# EAGLE design Threeno Tiny Tx Rev1B (EAGLE 9.6.2)
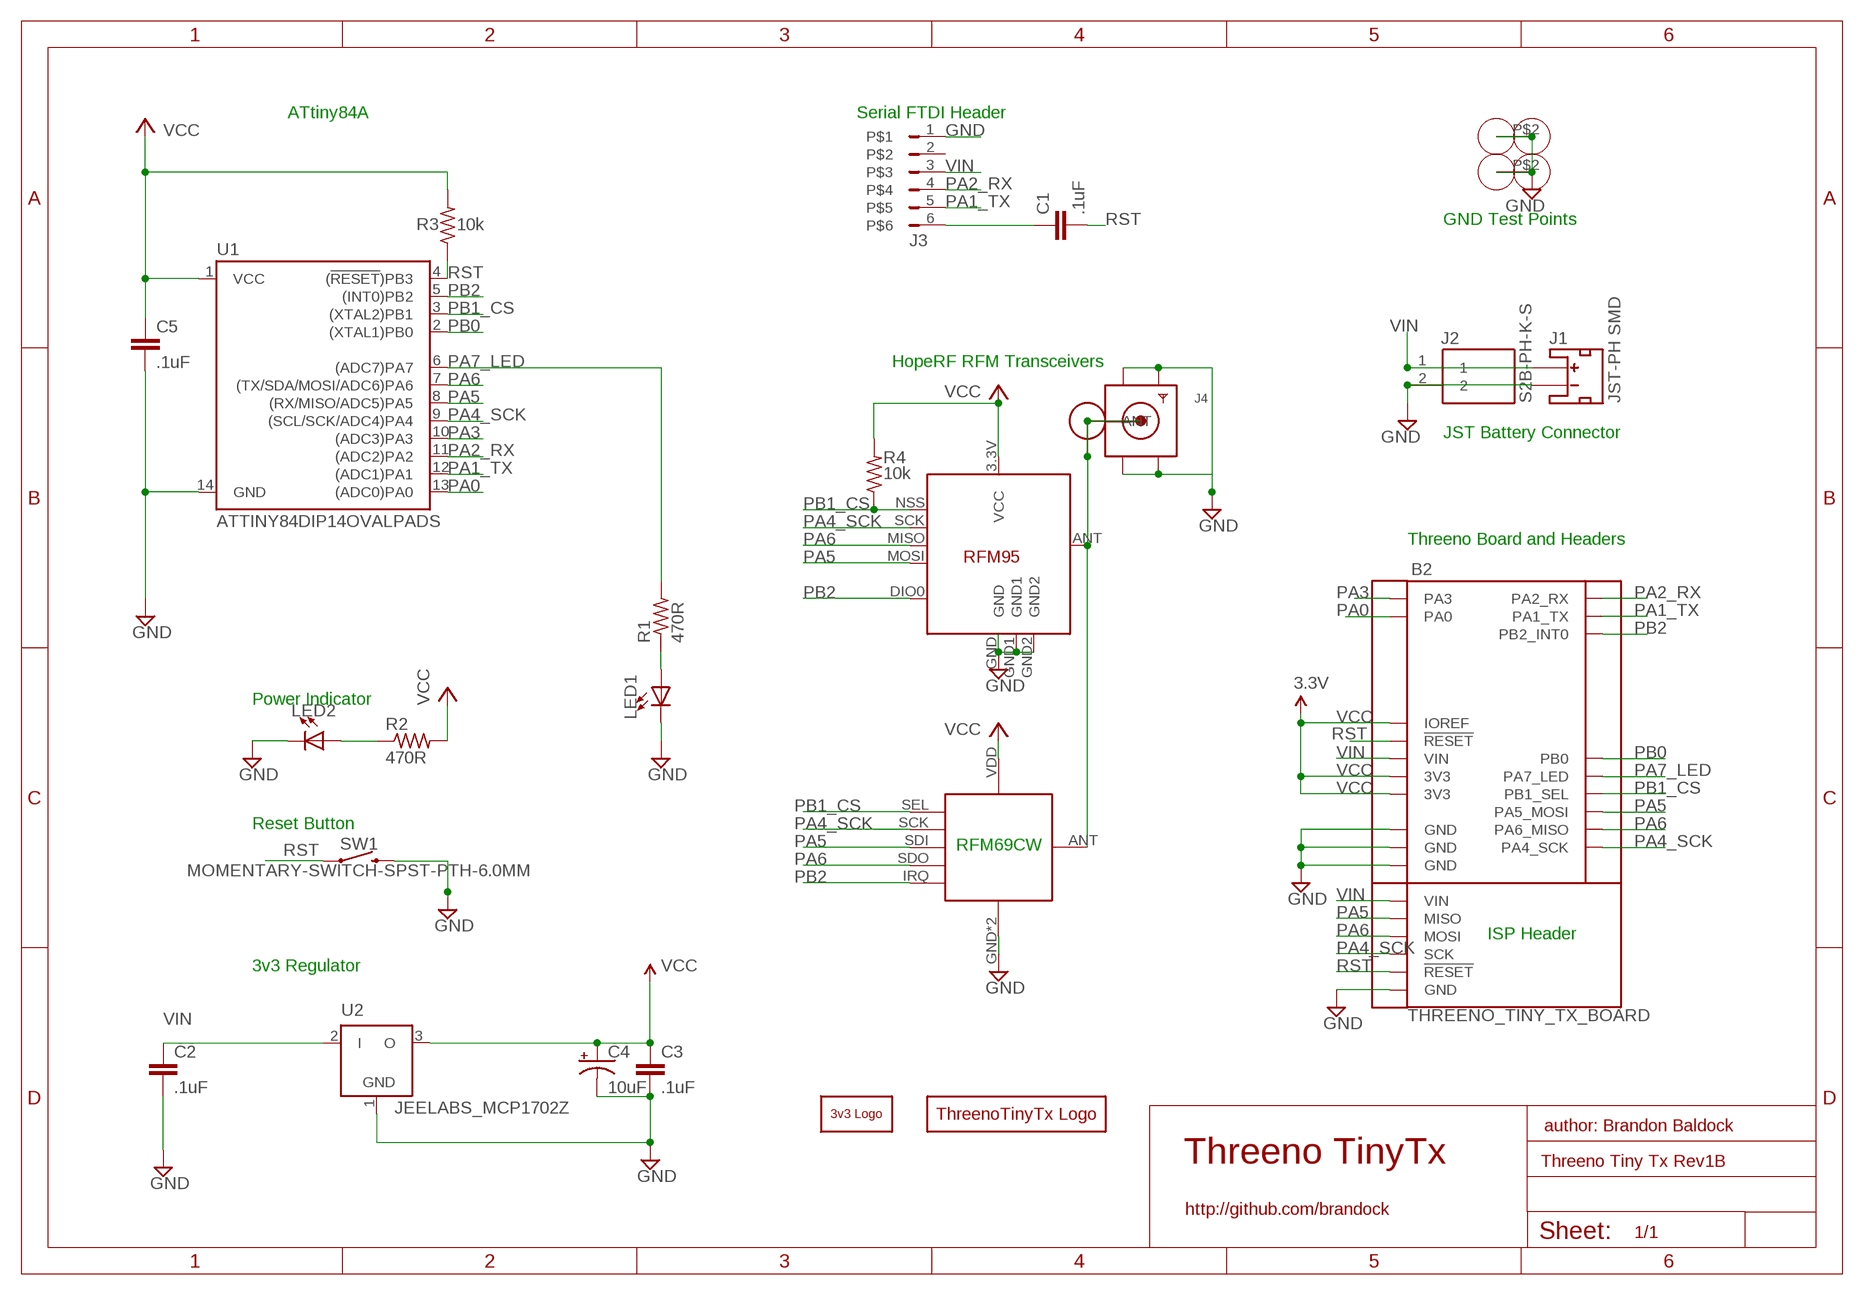
[diagram p0: schematic, sheet 1]

## Parts
B1  3VTHREENO_BOTTOM_SILK  [3VTHREENO_BOTTOM_SILK]
B2  THREENO_TINY_TX_BOARD  [THREENO_TINY_TX_BOARD]
B3  THREENO_TINY_TX_LOGOTHREENO_TINY_TX_LOGO  [THREENO_TINY_TX_LOGO]
C1  .1uF  C-EU025-024X044-NO_MIDDLE_SILK  [C025-024X044-NO-MIDDLE-SILK]
C2  .1uF  C-EU025-024X044-NO_MIDDLE_SILK  [C025-024X044-NO-MIDDLE-SILK]
C3  .1uF  C-EU025-024X044-NO_MIDDLE_SILK  [C025-024X044-NO-MIDDLE-SILK]
C4  10uF  CPOL-USE1.8-4  [E1,8-4]
C5  .1uF  C-EU025-024X044-NO_MIDDLE_SILK  [C025-024X044-NO-MIDDLE-SILK]
J1  JST_2MM_MALE  [JST-2-SMD]
J2  S2B-PH-K-S  [S2BPHKS]
J3  FTDI  [FTDI_ROUND_HEADER_SILK]
J4  SMACONNECTOR_EDGE  [SMA_EDGELAUNCH]
J5  RFM12B_ANTENNA  [RFM12B-ANTENNA]
J6  ALLIGATORCLIP-WIRELOOPTESTPOINT-WIRELOOP  [ALLIGATORCLIP-WIRELOOP]
J7  ALLIGATORCLIP-WIRELOOPTESTPOINT-WIRELOOP  [ALLIGATORCLIP-WIRELOOP]
LED1  LED-BRANDOCK3MM  [LED3MM-BRANDOCK]
LED2  LED-BRANDOCK3MM  [LED3MM-BRANDOCK]
R1  470R  R-US_0204/7  [0204/7]
R2  470R  R-US_0204/7  [0204/7]
R3  10k  R-US_0204/7  [0204/7]
R4  10k  R-US_0204/7  [0204/7]
RF1  RFM12B_MINPADS  [RFM12B-MINPADS]
RF2  RFM95LONGER  [RFM95_LONGER]
SW1  MOMENTARY-SWITCH-SPST-PTH-6.0MM  [TACTILE_SWITCH_PTH_6.0MM]
U1  ATTINY84DIP14OVALPADS  [DIP14-OVALPADS]
U2  JEELABS_MCP1702Z  [JEELABS_TO92]

## Nets
GND [power]: B2.GND@1(GND) B2.GND@2(GND) B2.GND@3(GND) B2.GND@ICSP(GND) C2.2 C3.2 C4.- C5.2 J1.1(-) J2.2 J3.1 J4.GND@1(GND4) J4.GND@2(GND3) J4.GND@3(GND2) J4.GND@4(GND1) J6.P$1 J6.P$2 J7.P$1 J7.P$2 LED1.K(C) LED2.K(C) RF1.GND RF1.GND2(GND) RF2.GND RF2.GND1 RF2.GND2 SW1.3 U1.14(GND) U2.1(GND)
N$2: LED2.A R2.1
N$3: J4.P(ANT) J5.P$1 RF1.ANT RF2.ANT
N$5: C1.1 J3.6
N$14: LED1.A R1.1
PA0: B2.PA0 U1.13((ADC0)PA0)
PA1_TX: B2.PA1(PA1_TX) J3.5 U1.12((ADC1)PA1)
PA2_RX: B2.PA2(PA2_RX) J3.4 U1.11((ADC2)PA2)
PA3: B2.PA3 U1.10((ADC3)PA3)
PA4_SCK: B2.PA4(PA4_SCK) B2.SCK@ICSP(SCK) RF1.SCK RF2.SCK U1.9((SCL/SCK/ADC4)PA4)
PA5: B2.MISO@ICSP(MISO) B2.PA5(PA5_MOSI) RF1.SDI(SDI/MOSI) RF2.MOSI U1.8((RX/MISO/ADC5)PA5)
PA6: B2.MOSI@ICSP(MOSI) B2.PA6(PA6_MISO) RF1.SDO(SDO/MISO) RF2.MISO U1.7((TX/SDA/MOSI/ADC6)PA6)
PA7_LED: B2.PA7(PA7_LED) R1.2 U1.6((ADC7)PA7)
PB0: B2.PB0 U1.2((XTAL1)PB0)
PB1_CS: B2.PB1(PB1_SEL) R4.1 RF1.SEL RF2.NSS(SEL) U1.3((XTAL2)PB1)
PB2: B2.PB2(PB2_INT0) RF1.IRQ RF2.DIO0 U1.5((INT0)PB2)
RST: B2.!RESET! B2.RESET@ICSP(!RESET!) C1.2 R3.1 SW1.1 U1.4((!RESET!)PB3)
VCC: B2.3.3V(3V3) B2.3.3V@2(3V3) B2.IOREF C3.1 C4.+ C5.1 R2.2 R3.2 R4.2 RF1.VDD RF2.3.3V(VCC) U1.1(VCC) U2.3(O) ; supply symbol labelled 3.3V
VIN: B2.VIN B2.VIN@ICSP(VIN) C2.1 J1.2(+) J2.1 J3.3 U2.2(I)
Unconnected: J1.NC1(PAD1) J1.NC2(PAD2) J3.2

## Notes on the sheet
- ATtiny84A | Serial FTDI Header
- GND Test Points
- (Arduino header position)
- (D2)
- (D10)
- (D8)
- (D9) | HopeRF RFM Transceivers
- (D12)
- (D11) | S2B-PH-K-S | JST-PH SMD
- (D13)
- (A0) | JST Battery Connector
- (D0)
- (D1)
- (A1)
- Threeno Board and Headers
- Power Indicator
- Reset Button
- RFM69CW
- ISP Header
- 3v3 Regulator
- author: Brandon Baldock
- Threeno TinyTx
- http://github.com/brandock

## Library data of the parts
B1 = 3VThreeno:3VTHREENO_BOTTOM_SILK: Arduino R3 Footprint with SPI header Arduino Uno R3 Compatible Footprint. Matches PCB size of the original board. SparkFun Products: SAMD21 Dev Breakout <https://www.sparkfun.com/products/13672> RedBoard <https://www.sparkfun.com/products/12757> R3 Stackable Headers <https://www.sparkfun.com/products/11417>
B2 = 3VThreeno:THREENO_TINY_TX_BOARD
B3 = 3VThreeno:THREENO_TINY_TX_LOGO: Arduino R3 Footprint with SPI header Arduino Uno R3 Compatible Footprint. Matches PCB size of the original board. SparkFun Products: SAMD21 Dev Breakout <https://www.sparkfun.com/products/13672> RedBoard <https://www.sparkfun.com/products/12757> R3 Stackable Headers <https://www.sparkfun.com/products/11417>
C1-C3 C5 = rcl-brandock:C-EU: CAPACITOR, European symbol
C4 = rcl:CPOL-US: POLARIZED CAPACITOR, American symbol; SPICEPREFIX: C
J1 = SparkFun-Connectors:JST_2MM_MALE: JST 2MM MALE RA CONNECTOR Two pin, compact surface mount connector. Commonly used as a battery input connection point. We really like the solid locking feeling and high current rating on these small connectors. We use these all the time as battery connectors. Mates to single-cell LiPo batteries. Here is the connector we sell at SparkFun: JST Right Angle Connector - White <https://www.sparkfun.com/products/8612> (PRT-08612) Datasheet <http://www.sparkfun.com/datasheets/Prototyping/Connectors/JST-Horizontal.pdf> It was used on these SparkFun products: SparkFun MOSFET Power Controller <https://www.sparkfun.com/products/11214> (PRT-11214) SparkFun Battery Babysitter - LiPo Battery Manager <https://www.sparkfun.com/products/13777> (PRT-13777) And many, many others that required a lipo battery connection.; PROD_ID: CONN-11443; SF_ID: PRT-08612
J2 = JST PH Thru Hole S2B-PH-K-S:S2B-PH-K-S: CONN HEADER R/A 2POS 2MM Source: Datasheet <https://media.digikey.com/pdf/Data Sheets/JST PDFs/PH Series.pdf>; DESCRIPTION: CONN HEADER R/A 2POS 2MM; HEIGHT: 4.8mm; MANUFACTURER_NAME: JST (JAPAN SOLDERLESS TERMINALS); MANUFACTURER_PART_NUMBER: S2B-PH-K-S
J3 = FTDI:FTDI: JUMPER
J4 = adafruit:SMACONNECTOR: SMA Connector 90° DIP SMA Connector, 50 Ohm (4UConnector: 07259)
J5 = LowPowerLab:RFM12B_ANTENNA
J6 J7 = Alligator Clip:ALLIGATORCLIP-WIRELOOP
LED1 LED2 = adafruit:LED-BRANDOCK: LED OSRAM: - CHIPLED LG R971, LG N971, LY N971, LG Q971, LY Q971, LO R971, LY R971 LH N974, LH R974 LS Q976, LO Q976, LY Q976 LO Q996 - Hyper CHIPLED LW Q18S LB Q993, LB Q99A, LB R99A - SideLED LS A670, LO A670, LY A670, LG A670, LP A670 LB A673, LV A673, LT A673, LW A673 LH A674 LY A675 LS A676, LA A676, LO A676, LY A676, LW A676 LS A679, LY A679, LG A679 - Hyper Micro SIDELED® LS Y876, LA Y876, LO Y876, LY Y876 LT Y87S - SmartLED LW L88C, LW L88S LB L89C, LB L89S, LG L890 LS L89K, LO L89K, LY L89K LS L896, LA L896, LO L896, LY L896 - TOPLED LS T670, LO T670, LY T670, LG T670, LP T670 LSG T670, LSP T670, LSY T670, LOP T670, LYG T670 LG T671, LOG T671, LSG T671 LB T673, LV T673, LT T673, LW T673 LH T674 LS T676, LA T676, LO T676, LY T676, LB T676, LH T676, LSB T676, LW T676 LB T67C, LV T67C, LT T67C, LS T67K, LO T67K, LY T67K, LW E67C LS E67B, LA E67B, LO E67B, LY E67B, LB E67C, LV E67C, LT E67C LW T67C LS T679, LY T679, LG T679 LS T770, LO T770, LY T770, LG T770, LP T770 LB T773, LV T773, LT T773, LW T773 LH T774 LS E675, LA E675, LY E675, LS T675 LS T776, LA T776, LO T776, LY T776, LB T776 LHGB T686 LT T68C, LB T68C - Hyper Mini TOPLED® LB M676 - Mini TOPLED Santana® LG M470 LS M47K, LO M47K, LY M47K Source: http://www.osram.convergy.de/
R1-R4 = rcl-brandock:R-US_: RESISTOR, American symbol; SPICEPREFIX: R
RF1 = RFM_MiniPads:RFM12B_MINPADS
RF2 = RFM_MiniPads:RFM95
SW1 = SparkFun-Switches:MOMENTARY-SWITCH-SPST: Momentary Switch (Pushbutton) - SPST Normally-open (NO) SPST momentary switches (buttons, pushbuttons). Variants PTH-12MM - 12mm square, through-hole Momentary Pushbutton Switch - 12mm Square <https://www.sparkfun.com/products/9190> (COM-09190) PTH-6.0MM, PTH-6.0MM-KIT - 6.0mm square, through-hole Mini Pushbutton Switch <https://www.sparkfun.com/products/97> (COM-00097) KIT package intended for soldering kit's - only one side of pads' copper is exposed. PTH-RIGHT-ANGLE-KIT - Right-angle, through-hole Right Angle Tactile Button <https://www.sparkfun.com/products/10791> - Used on SparkFun BigTime Watch Kit <https://www.sparkfun.com/products/11734> SMD-12MM - 12mm square, surface-mount Tactile Button - SMD (12mm) <https://www.sparkfun.com/products/12993> (COM-12993) Used on SparkFun PicoBoard <https://www.sparkfun.com/products/11888> SMD-4.5MM - 4.5mm Square Trackball Switch Used on SparkFun Blackberry Trackballer Breakout <https://www.sparkfun.com/products/13169> SMD-4.6MMX2.8MM - 4.60mm x 2.80mm, surface mount Used on SparkFun SAMD21 Mini Breakout <https://www.sparkfun.com/products/13664> SMD-5.2MM, SMD-5.2-REDUNDANT - 5.2mm square, surface-mount Mini Pushbutton Switch - SMD <https://www.sparkfun.com/products/8720> (COM-08720) Used on Arduino Pro Mini <https://www.sparkfun.com/products/11114> REDUNDANT package connects both switch circuits together SMD-6.0X3.5MM - 6.0 x 3.5mm, surface mount Momentary Reset Switch SMD <https://www.sparkfun.com/products/8229> (COM-08229) SMD-6.2MM-TALL - 6.2mm square, surface mount Tactile Button - SMD (6mm) <https://www.sparkfun.com/products/12992> Used on SparkFun Digital Sandbox <https://www.sparkfun.com/products/12651> SMD-RIGHT-ANGLE - Right-angle, surface mount Used on SparkFun Block for Intel® Edison - Arduino <https://www.sparkfun.com/products/13036>; PROD_ID: SWCH-08441; SF_SKU: COM-00097
U1 = SparkFun-IC-Microcontroller:ATTINY84: Atmel 14-pin 2/4/8kB flash uC Datasheet <https://cdn.sparkfun.com/datasheets/Widgets/doc8006.pdf> SparkFun Products Tiny AVR Programmer <https://www.sparkfun.com/products/11801> (PGM-11801) SparkFun Servo Trigger - Continuous Rotation <https://www.sparkfun.com/products/13872> (WIG-13872) SparkFun Servo Trigger <https://www.sparkfun.com/products/13118> (WIG-13118)
U2 = JeeLib:JEELABS_MCP1702: 200 mA, Low Power Low Dropout Voltage Regulator

## Net classes
1 power: width 0.381 mm, clearance 0.254 mm

## Board
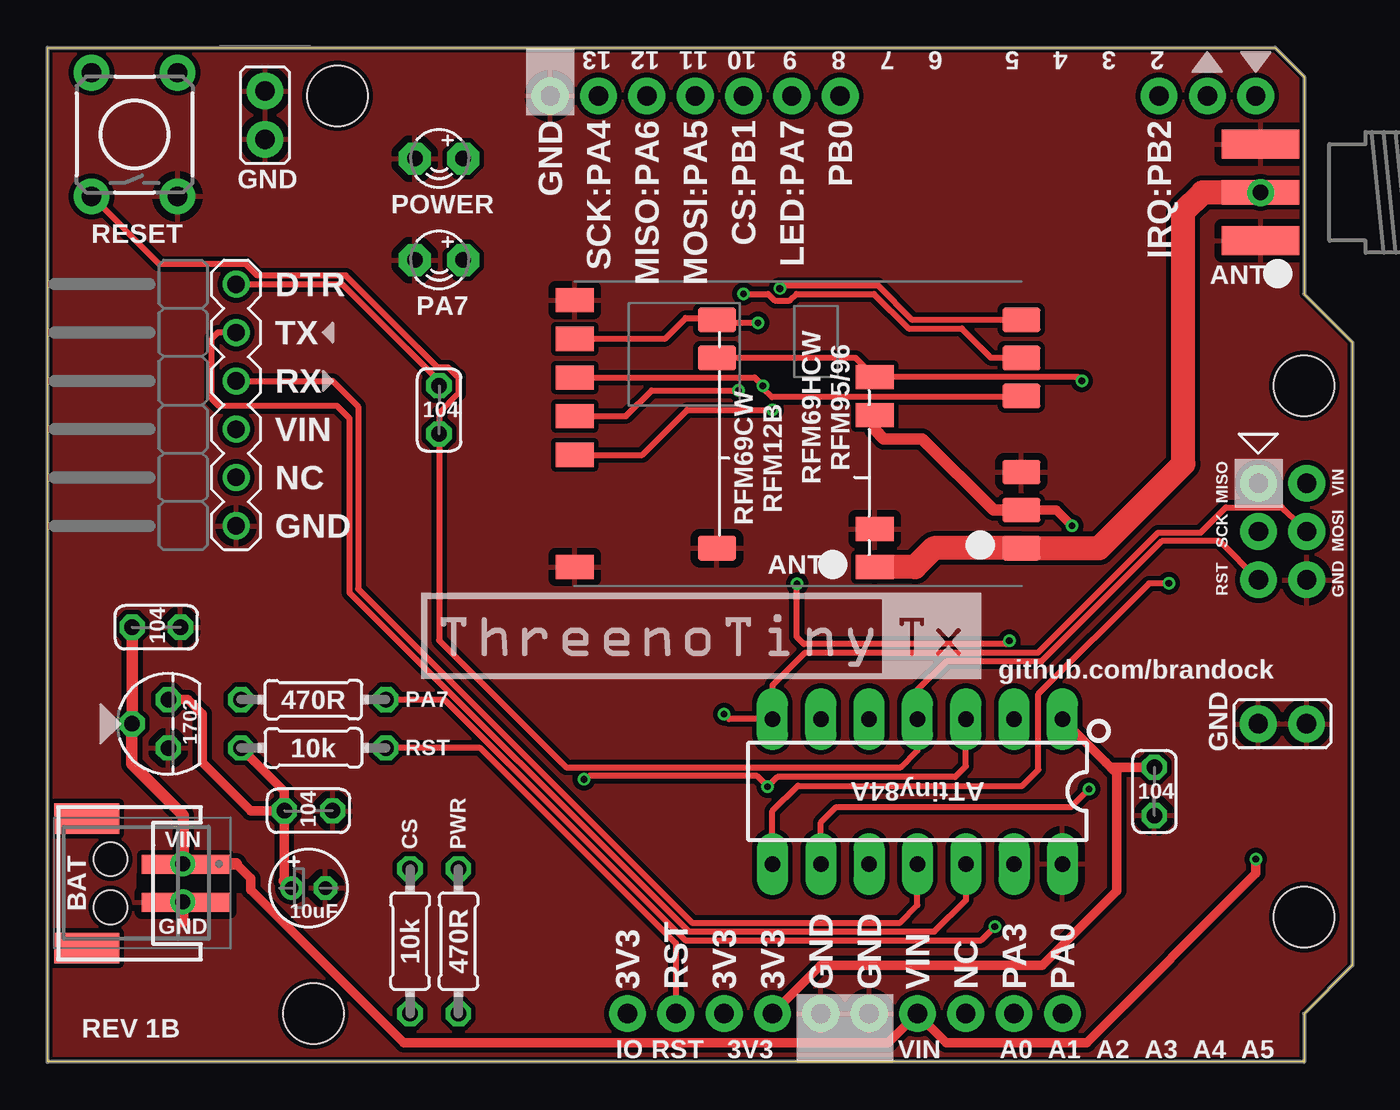
[diagram p1: board, top side]
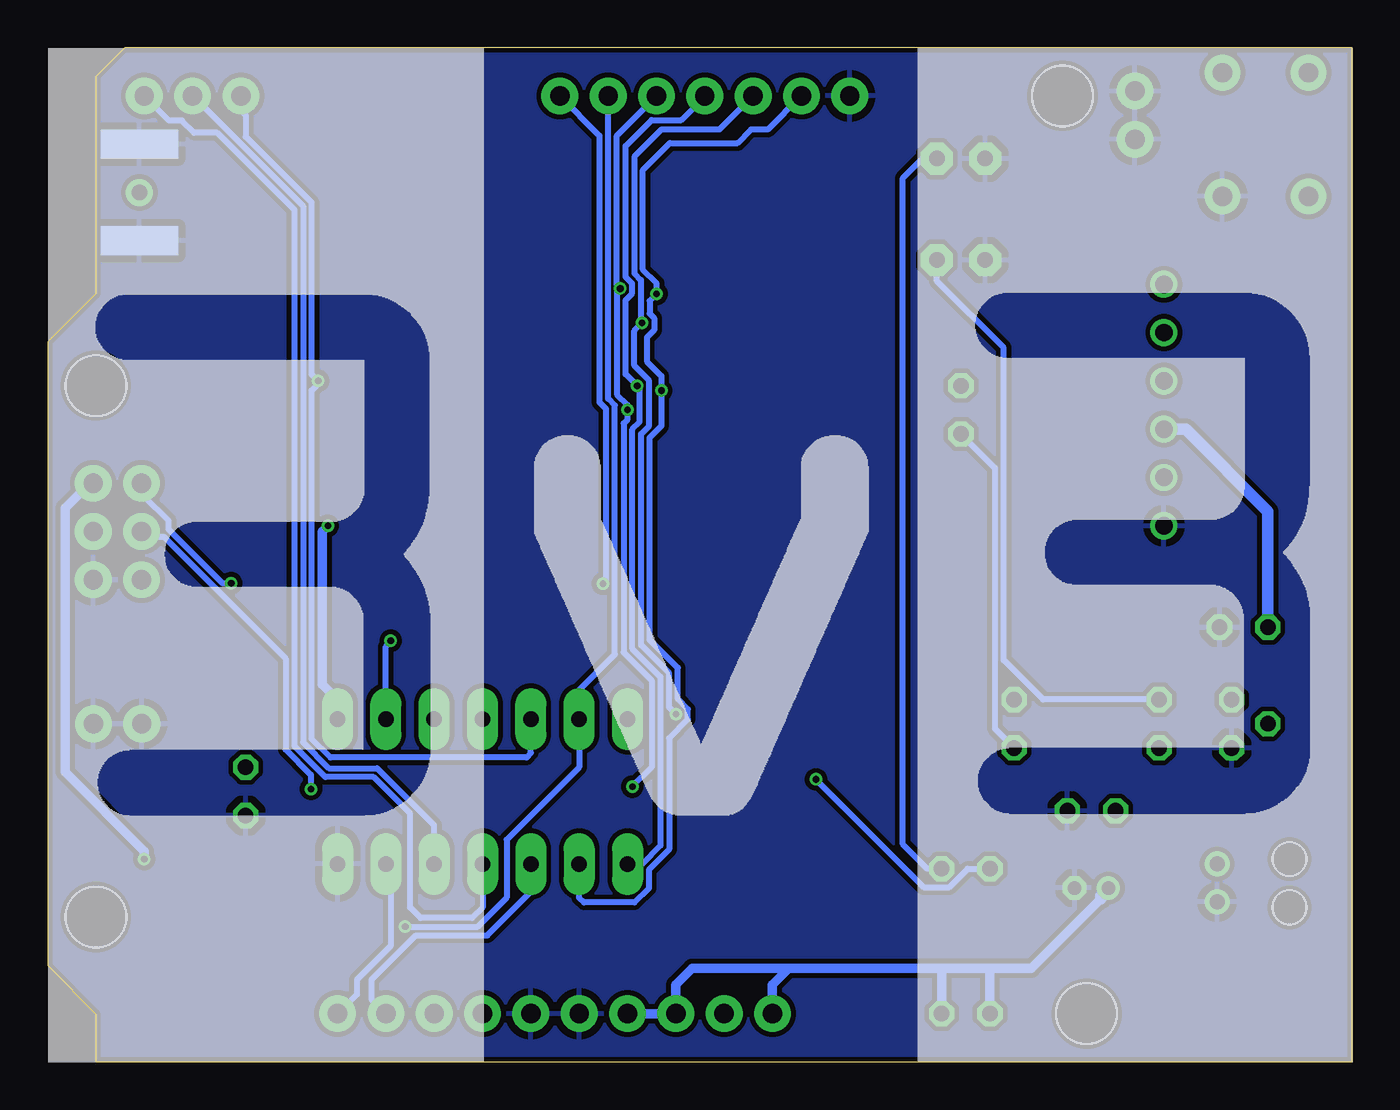
[diagram p2: board, bottom side, seen from below]

Size 68.58 x 53.34 mm. Coordinates in mm from the lower left corner, seen from the top.
Outline: 0,53.34 64.52,53.34 66.04,51.82 66.04,40.39 68.58,37.85 68.58,5.08 66.04,2.54 66.04,0 0,0 0,53.34
Copper layers (1*16): Top 0.035mm / dielectric 1.5mm / Bottom 0.035mm
Design rules "ITEADstudio_DRC *": minimum track width 6mil, minimum drill 12mil, track to track 6mil, track to pad 6mil, pad to pad 6mil, via to via 6mil, smd to smd 0mil, copper to edge 10mil, drill to drill 10mil, minimum pad ring 10mil, minimum via ring 6mil, stop-mask expansion 2mil, vias tented up to drill 100mil, thermal gap 15mil
Holes 1.78 mm at 3.3,10.67 3.3,8.13
tRestrict: area 9.3,7.9 to 9.9,8.9; area 5,8.9 to 10.2,9.9; area 4.7,9.2 to 5,9.9

### Footprints (pad centres in the part's own frame; a part is rotated, then mirrored left to right if it is on the bottom)
THREENO_TINY_TX_BOARD = drill 1.016 pad 1.93: 3.3V 2.54,-24.13; 3.3V@2 5.08,-24.13; !RESET! 0,-24.13; GND@1 7.62,-24.13; GND@2 10.16,-24.13; GND@3 -6.604,24.13; GND@ICSP 33.16,-1.32; IOREF -2.54,-24.13; MISO@ICSP 30.62,3.76; MOSI@ICSP 33.16,1.22; NC 15.24,-24.13; PA0 20.32,-24.13; PA1 27.94,24.13; PA2 30.48,24.13; PA3 17.78,-24.13; PA4 -4.064,24.13; PA5 1.016,24.13; PA6 -1.524,24.13; PA7 6.096,24.13; PB0 8.636,24.13; PB1 3.556,24.13; PB2 25.4,24.13; RESET@ICSP 30.62,-1.32; SCK@ICSP 30.62,1.22; VIN 12.7,-24.13; VIN@ICSP 33.16,3.76 | hole 3.175: -17.78,24.13; 33.02,8.89; 33.02,-19.05; -19.05,-24.13
C025-024X044-NO-MIDDLE-SILK = drill 0.813 octagon: 1 -1.27,0; 2 1.27,0
E1,8-4 = drill 0.711 pad 1.168: + -0.889,0 | drill 0.711 pad 1.168 octagon: - 0.889,0
JST-2-SMD = smd 1 x 4.6: 1 -1,-3.7; 2 1,-3.7 | smd 1.6 x 3.4: NC1 -3.4,1.5; NC2 3.4,1.5
S2BPHKS = drill 0.8 pad 1.3: 1 0,0; 2 -2,0
FTDI_ROUND_HEADER_SILK = drill 0.914: 1 -2.54,-1.27; 2 0,-1.27; 3 2.54,-1.27; 4 5.08,-1.27; 5 7.62,-1.27; 6 10.16,-1.27
SMA_EDGELAUNCH = smd 4.064 x 1.524: GND@1 2.032,-2.54; GND@2 2.032,2.54 | smd 4.064 x 1.524 bottom: GND@3 2.032,2.54; GND@4 2.032,-2.54 | smd 4.064 x 1.27: P 2.032,0
RFM12B-ANTENNA = drill 0.8 pad 1.422: P$1 0,0
ALLIGATORCLIP-WIRELOOP = drill 1.016 pad 1.93: P$1 -2.54,0; P$2 0,0
LED3MM-BRANDOCK = drill 0.813 pad 1.676 octagon: A -1.27,0; K 1.27,0
0204/7 = drill 0.813 octagon: 1 -3.81,0; 2 3.81,0
RFM12B-MINPADS = smd 2 x 1.27: ANT 8,-6; GND 8,-2; GND2 -8.002,-6.001; IRQ -8,4; SCK 8,4; SDI 8,2; SDO -8,6; SEL 8,6; VDD 8,-4
RFM95_LONGER = smd 2 x 1.27: 3.3V 7.651,1; ANT 7.651,-7; DIO0 7.651,3; GND 7.651,-5; GND1 -8.107,-7; GND2 -8.107,7.032; MISO -8.107,5; MOSI -8.107,2.968; NSS -8.107,-1.096; SCK -8.107,0.936
TACTILE_SWITCH_PTH_6.0MM = drill 1.016 pad 1.88: 1 -3.251,2.261; 2 3.251,2.261; 3 -3.251,-2.261; 4 3.251,-2.261
DIP14-OVALPADS = drill 0.813 pad 1.626 long: 1 -7.62,-3.81; 2 -5.08,-3.81; 3 -2.54,-3.81; 4 0,-3.81; 5 2.54,-3.81; 6 5.08,-3.81; 7 7.62,-3.81; 8 7.62,3.81; 9 5.08,3.81; 10 2.54,3.81; 11 0,3.81; 12 -2.54,3.81; 13 -5.08,3.81; 14 -7.62,3.81
JEELABS_TO92 = drill 0.813 octagon: 1 -1.27,0; 2 0,1.905; 3 1.27,0

### Placement (x,y rotation side)
B1  33.02,26.67 0 top
B2  33.02,26.67 0 top
B3  35.31,22.1 0 top
C1  20.57,34.29 270 top
C2  5.71,22.86 0 top
C3  13.72,13.21 0 top
C4  13.72,9.14 0 top
C5  58.17,14.22 270 top
J1  3.56,9.4 90 top
J2  7.11,10.41 90 top
J3  8.64,30.73 90 top
J4  65.79,45.72 180 top
J5  63.75,45.72 0 top
J6  66.17,17.78 0 top
J7  11.43,51.05 90 top
LED1  20.57,42.16 180 top
LED2  20.57,47.5 180 top
R1  13.97,19.05 0 top
R2  21.59,6.35 270 top
R3  13.97,16.51 180 top
R4  19.05,6.35 270 top
RF1  43.18,33.02 0 top
RF2  35.81,33.02 0 top
SW1  4.57,48.77 90 top
U1  45.72,14.22 180 top
U2  6.35,17.78 90 top

### Tracks (layer width: path | path; a pad name or v marks a point on that pad's centre or on a via)
GND
  Top 0.61: J2.2 7.11,7.37
  pour Top: 0,53.59 68.83,53.59 68.83,-0.51 0,-0.51
  pour Bottom: -0.25,53.85 68.83,53.85 68.83,0 -0.25,0
N$2
  Bottom 0.305: LED2.A 22.61,47.5 23.62,46.48 23.62,11.44 22.34,10.16 R2.1
N$3
  Top 1.27: J4.P 60.71,45.72 59.69,44.7 59.69,31.45 55.27,27.02 RF1.ANT 46.58,27.02 45.58,26.02 RF2.ANT
N$5
  Top 0.305: C1.1 20.57,35.81 15.49,40.89 J3.6
N$14
  Bottom 0.305: LED1.A 21.84,41.06 18.34,37.56 18.34,21.13 16.26,19.05 R1.1
PA0
  Bottom 0.305: U1.13 50.55,10.16 50.55,6.1 52.32,4.32 52.32,3.56 B2.PA0
PA1_TX
  Top 0.305: U1.12 48.26,8.51 46.61,6.86 33.7,6.86 15.87,24.69 15.87,33.85 15.22,34.49 9.01,34.49 8.64,34.86 8.64,38.03 8.96,38.35 J3.5
  Bottom 0.305: U1.12 48.26,12.45 51.26,15.44 53.79,15.44 55.16,16.81 55.16,44.99 B2.PA1
PA2_RX
  Top 0.305: J3.4 14.99,35.81 16.33,34.48 16.33,24.88 33.88,7.31 44.78,7.31 45.72,8.25 U1.11
  Bottom 0.305: B2.PA2 62.2,49.51 61.52,49.51 60.87,48.86 59.66,48.86 55.61,44.8 55.61,17.02 55.61,16.62 53.98,14.99 51.45,14.99 49.53,13.07 49.53,8.13 48.97,7.57 46.28,7.57 45.72,8.13 U1.11
PA3
  Bottom 0.305: U1.10 43.18,8.94 45.46,6.66 49.22,6.66 51.56,4.32 51.56,3.3 B2.PA3
PA4_SCK  (via drill 0.35)
  Top 0.305: 50.55,37.02 RF1.SCK 49.59,37.02 48.05,38.56 45.26,38.56 43.43,40.39 39.37,40.39 39.02,40.04 38.22,40.04 37.87,40.39 v36.58,40.39 | 27.43,33.96 RF2.SCK 30.4,33.96 31.75,35.31 v36.32,35.31 | v54.74,14.35 53.8,13.41 41.45,13.41 40.64,12.6 U1.9
  Bottom 0.305: U1.9 40.64,8.64 40.39,8.38 37.74,8.38 36.98,9.14 36.98,10.11 35.92,11.18 35.92,17.04 34.93,18.03 34.93,18.55 35.46,19.08 35.46,20.73 36.93,22.2 36.93,32.83 36.32,33.44 v36.32,35.31 36.32,36.07 37.08,36.83 37.08,38.1 36.71,38.48 36.71,39.12 36.94,39.35 36.94,40.02 v36.58,40.39 36.58,40.95 37.29,41.66 37.29,46.9 35.87,48.32 32.32,48.32 31.61,49.02 30.73,49.02 B2.PA4 | B2.SCK@ICSP 63.38,27.63 62.48,27.63 56.07,21.21 56.07,16.43 54.74,15.1 v54.74,14.35
PA5  (via drill 0.35)
  Top 0.305: U1.8 38.1,13.19 39.44,14.53 51.23,14.53 52.07,15.37 52.07,19.34 57.9,25.17 v58.93,25.17 | RF1.SDI 51.12,34.96 38.08,34.96 37.59,35.45 v37.59,35.56 37.16,35.99 RF2.MOSI
  Bottom 0.305: B2.MISO@ICSP 63.5,30.29 63.5,29.74 62.22,28.46 62.22,28.01 59.38,25.17 v58.93,25.17 | U1.8 37.34,10.41 36.37,11.38 36.37,20.26 37.85,21.73 37.85,33.27 37.47,33.65 37.47,35.44 v37.59,35.56 38.2,36.17 38.2,40.06 37.85,40.41 37.85,40.93 38.2,41.28 38.2,48.16 36.83,49.53 35.29,49.53 34.04,50.78 B2.PA5
PA6  (via drill 0.35)
  Top 0.305: v35.56,18.29 35.81,18.03 U1.7 38.1,19.81 39.8,21.52 52.05,21.52 58.37,27.84 60.61,27.84 61.93,29.16 64.87,29.16 65.05,28.98 B2.MOSI@ICSP | RF2.MISO 32.43,38.02 33.53,39.12 35.08,39.12 RF1.SDO 35.34,38.86 v37.34,38.86
  Bottom 0.305: v35.56,18.29 35.92,18.64 35.92,20.45 37.39,21.92 37.39,33.02 36.96,33.45 36.96,35.82 37.74,36.61 37.74,38.46 v37.34,38.86 37.39,38.92 37.39,41.12 37.74,41.47 37.74,47.6 36.32,49.02 33.27,49.02 B2.PA6
PA7_LED  (via drill 0.35)
  Top 0.305: R1.2 20.86,19.05 33.5,6.4 49.07,6.4 v49.78,7.11
  Bottom 0.305: v49.78,7.11 45.97,7.11 44.45,8.64 44.45,11.68 40.64,15.49 U1.6 40.64,19.56 38.76,21.44 38.76,34.52 39.12,34.88 B2.PA7
PB0  (via drill 0.35)
  Top 0.305: v39.39,25.15 39.37,25.12 39.37,22.35 39.75,21.97 50.37,21.97 v50.55,22.15
  Bottom 0.305: v50.55,22.15 50.55,22.1 50.8,21.84 U1.2 | v39.39,25.15 39.22,25.32 39.22,34.33 39.57,34.69 39.57,48.72 B2.PB0
PB1_CS  (via drill 0.35)
  Top 0.305: RF2.NSS 31.24,31.92 33.61,34.29 v38.1,34.29 | U1.3 48.26,15.55 47.7,14.99 38.35,14.99 v37.85,14.48 37.29,15.04 28.45,15.04 28.27,14.86 v28.19,14.86 | RF1.SEL 45.45,39.02 43.62,40.84 38.66,40.84 v38.48,40.67
  Bottom 0.305: v37.85,14.48 36.83,15.49 36.83,20.07 38.3,21.54 38.3,33.58 38.1,33.78 v38.1,34.29 38.1,34.54 38.66,35.1 38.66,40.59 38.58,40.67 v38.48,40.67 38.66,40.84 38.66,48.72 B2.PB1 | v28.19,14.86 22.53,9.2 21.19,9.2 20.23,10.16 R4.1
PB2  (via drill 0.35)
  Top 0.305: v54.36,35.81 54.15,36.02 RF2.DIO0 42.46,37.02 RF1.IRQ
  Bottom 0.305: B2.PB2 58.42,50.04 58.17,49.78 58.17,48.65 54.7,45.18 54.7,36.15 v54.36,35.81 54.36,35.65 54.7,35.31 54.7,17 53.7,16 43.41,16 43.18,16.26 U1.5
RST
  Top 0.305: B2.RESET@ICSP 61.61,27.38 58.56,27.38 52.24,21.06 47.22,21.06 45.72,19.56 U1.4 45.72,16.38 44.83,15.49 27.25,15.49 20.57,22.17 C1.2 20.57,34.12 21.59,35.14 21.59,36.07 21.5,36.07 21.05,36.52 20.51,36.52 15.68,41.35 11.02,41.35 10.41,41.96 5.87,41.96 SW1.1 | B2.!RESET! 33.02,6.24 22.75,16.51 R3.1
  Bottom 0.305: C1.2 18.8,31.24 18.8,17.53 R3.1
VCC  (via drill 0.35)
  Top 0.508: 12.45,9.52 C3.1 | B2.3.3V@2 40.64,5.08 52.27,5.08 56.18,9 56.18,15.19 55.88,15.49 | U2.3 7.37,19.05 8.13,18.29 8.13,15.75 10.67,13.21 C3.1 | C3.1 12.45,14.22 R3.2 | v53.85,28.19 53.02,29.02 RF1.VDD | U1.1 55.63,15.75 55.88,15.49 | C5.1 55.88,15.49
  Top 0.61: C4.+ 12.45,9.52 | RF2.3.3V 43.46,33.24 43.94,32.77 45.97,32.77 49.72,29.02 RF1.VDD
  Bottom 0.508: B2.IOREF 30.48,4.06 29.62,4.93 | 13.23,8.58 16.88,4.93 19.05,4.93 | 19.05,4.93 21.59,4.93 | 29.62,4.93 21.59,4.93 | 29.62,4.93 34.7,4.93 35.56,4.06 B2.3.3V B2.3.3V@2 | U1.1 53.34,19.05 54.14,19.85 54.14,27.9 v53.85,28.19 | 19.05,4.93 R4.2 | 21.59,4.93 R2.2
  Bottom 0.61: C4.+ 13.23,8.74 13.23,8.58
VIN  (via drill 0.35)
  Top 0.305: J1.2 7.13,10.4
  Top 0.508: 9.91,10.41 10.67,9.65 10.67,9.06 18.71,1.02 44.2,1.02 B2.VIN 47.24,1.02 54.61,1.02 63.5,9.91 v63.5,10.67
  Top 0.61: 7.13,10.4 J2.1 | 7.13,10.41 9.91,10.41 | J1.2 7.14,10.4 7.13,10.41 | C2.1 U2.2 4.42,17.76 4.42,15.67 7.13,12.96 7.13,10.41
  Bottom 0.508: B2.VIN@ICSP 66.34,30.43 67.65,29.12 67.65,15.24 63.5,11.09 v63.5,10.67
  Bottom 0.61: J3.3 8.76,33.27 4.45,28.96 C2.1

### Text on the board
tPlace: 13 | 12 | 11 | 10 | 9 | 8 | 7 | 6 | 5 | 4 | 3 | 2 | GND | POWER | RESET | ANT | DTR | PA7 | TX | RX | 104 | RFM69HCW / RFM95/96 | VIN | RFM69CW / RFM12B | NC | MISO | VIN | GND | SCK | MOSI | ANT | RST | GND | 104 | 470R | PA7 | 1702 | GND | 10k | RST | ATtiny84A | 104 | 104 | VIN | CS | PWR | BAT | 10uF | GND | 10k | 470R | IO | RST | 3V3 | VIN | A0 | A1 | A2 | A3 | A4 | A5
tNames: github.com/brandock | REV 1B